# Altium schematic sheet K60DN_LQFP100.SchDoc
size A4
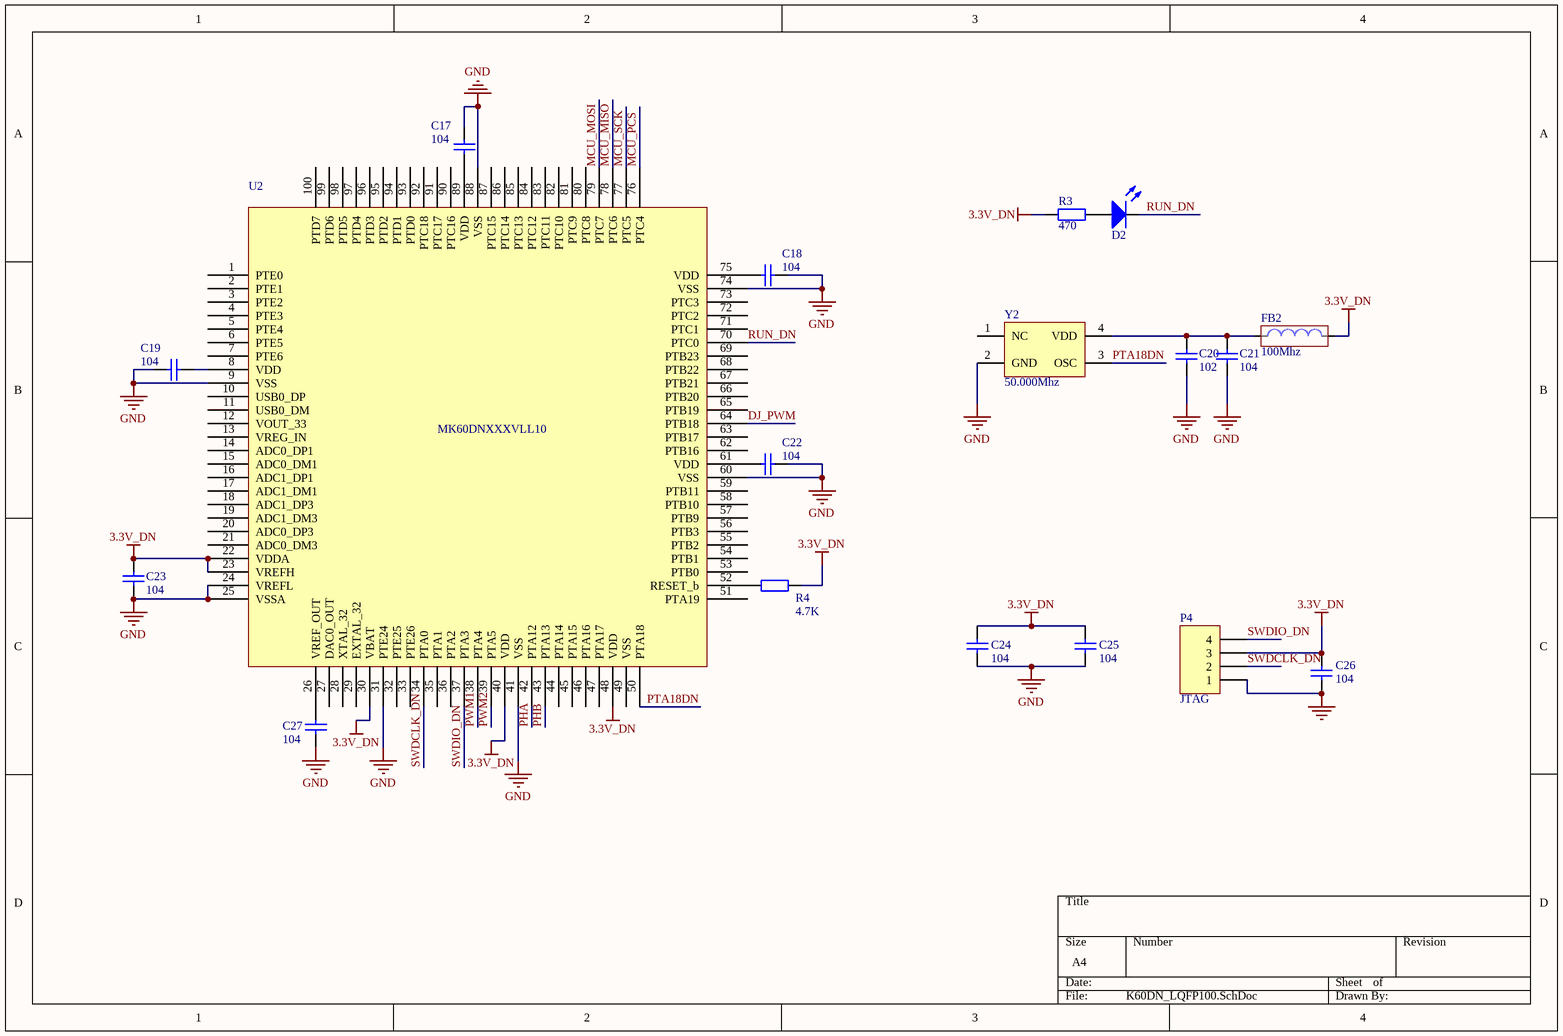
[diagram p0: K60DN_LQFP100.SchDoc]

## Parts
C17  104  [0805]
C18  104  [0805]
C19  104  [0805]
C20  102  [0805]
C21  104  [0805]
C22  104  [0805]
C23  104  [0805]
C24  104  [0805]
C25  104  [0805]
C26  104  [0805]
C27  104  [0805]
D2  Led  [0805]  (value not drawn)
FB2  100Mhz  [0805]
P4  JTAG  [PJ-322]
R3  470  [0805]
R4  4.7K  [0805]
U2  MK60DNXXXVLL10  [LQFP-100]
Y2  50.000Mhz  [XTAL-3225]

## Nets
3.3V_DN: C23.2 C24.2 C25.2 C26.1 FB2.2 P4.3 R3.1 R4.2 U2.22(VDDA) U2.23(VREFH) U2.30(VBAT) U2.40(VDD) U2.48(VDD)
GND: C17.2 C18.1 C19.1 C20.1 C21.1 C22.1 C23.1 C24.1 C25.1 C26.2 C27.1 P4.1 U2.9(VSS) U2.24(VREFL) U2.25(VSSA) U2.31(PTE24) U2.41(VSS) U2.60(VSS) U2.74(VSS) U2.88(VSS) Y2.2(GND)
DJ_PWM: U2.64(PTB18)
MCU_MISO: U2.78(PTC6)
MCU_MOSI: U2.79(PTC7)
MCU_PCS: U2.76(PTC4)
MCU_SCK: U2.77(PTC5)
PHA: U2.42(PTA12)
PHB: U2.43(PTA13)
PTA18DN: U2.50(PTA18) Y2.3(OSC)
PWM1: U2.38(PTA4)
PWM2: U2.39(PTA5)
RUN_DN: D2.2 U2.70(PTC0)
SWDCLK_DN: P4.2 U2.34(PTA0)
SWDIO_DN: P4.4 U2.37(PTA3)
NetC17_1: C17.1 U2.89(VDD)
NetC18_2: C18.2 U2.75(VDD)
NetC19_2: C19.2 U2.8(VDD)
NetC20_2: C20.2 C21.2 FB2.1 Y2.4(VDD)
NetC22_2: C22.2 U2.61(VDD)
NetC27_2: C27.2 U2.26(VREF_OUT)
NetD2_1: D2.1 R3.2
NetR4_1: R4.1 U2.52(RESET_b)

Not connected (* = marked no-connect by the designer): U2 1(PTE0) 2(PTE1) 3(PTE2) 4(PTE3) 5(PTE4) 6(PTE5) 7(PTE6) 10(USB0_DP) 11(USB0_DM) 12(VOUT_33) 13(VREG_IN) 14(ADC0_DP1) 15(ADC0_DM1) 16(ADC1_DP1) 17(ADC1_DM1) 18(ADC1_DP3) 19(ADC1_DM3) 20(ADC0_DP3) 21(ADC0_DM3) 27(DAC0_OUT) 28(XTAL_32) 29(EXTAL_32) 32(PTE25) 33(PTE26) 35(PTA1) 36(PTA2) 44(PTA14) 45(PTA15) 46(PTA16) 47(PTA17) 49(VSS) 51(PTA19) 53(PTB0) 54(PTB1) 55(PTB2) 56(PTB3) 57(PTB9) 58(PTB10) 59(PTB11) 62(PTB16) 63(PTB17) 65(PTB19) 66(PTB20) 67(PTB21) 68(PTB22) 69(PTB23) 71(PTC1) 72(PTC2) 73(PTC3) 80(PTC8) 81(PTC9) 82(PTC10) 83(PTC11) 84(PTC12) 85(PTC13) 86(PTC14) 87(PTC15) 90(PTC16) 91(PTC17) 92(PTC18) 93(PTD0) 94(PTD1) 95(PTD2) 96(PTD3) 97(PTD4) 98(PTD5) 99(PTD6) 100(PTD7); Y2 1(NC)

## Library data of the parts
C17-C27 = Cap
FB2 = Inductor
P4 = Header 4: Header, 4-Pin; LatestRevisionDate: 17-Jul-2002; LatestRevisionNote: Re-released for DXP Platform.; Publisher: Altium Limited
R3 R4 = Rest
U2 = K60_100PIN
Y2 = 有源晶振